# EAGLE schematic Project_schematic (EAGLE 9.6.1)
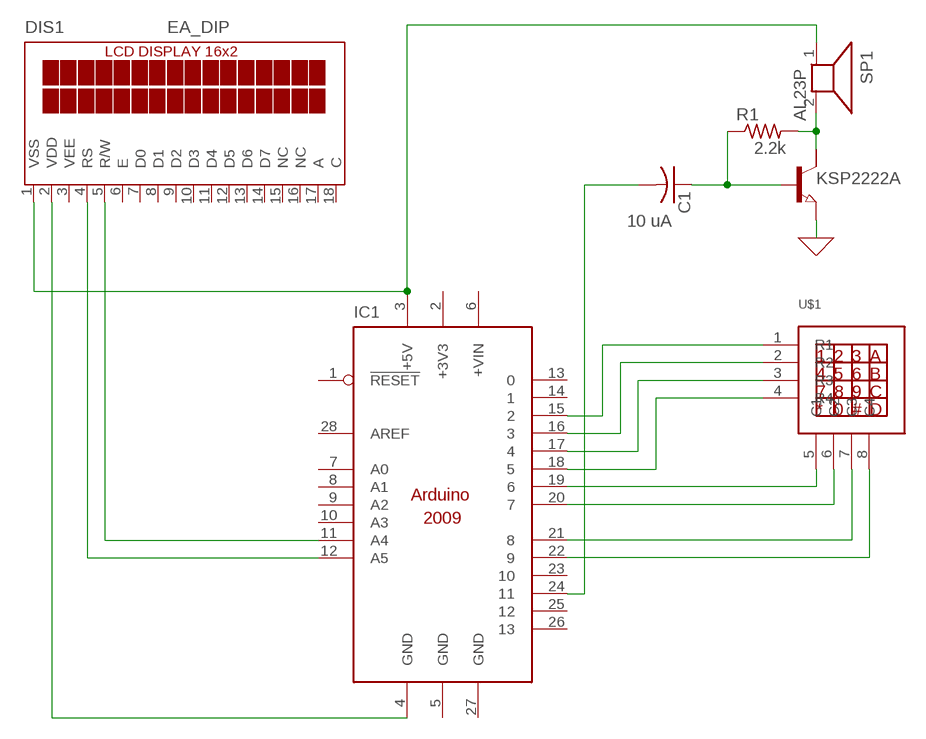
[diagram p0: schematic, sheet 1]

## Parts
C1  10 uA  C-US025-040X050  [C025-040X050]
DIS1  EA_DIP  [EA_DIP]
IC1  ARDUINO2009_10  [ARDUINO2009]
KSP2222A  NPN-TRANSISTIOR-2COLSOT89  [SOT89]
R1  2.2k  R-US_0204/7  [0204/7]
SP1  AL23P  [AL23P]
U$1  KEYPAD4X4  [KEYPAD4X4]

## Nets
N$1: DIS1.1(VSS) IC1.3(+5V) SP1.1
N$2: DIS1.2(VDD) IC1.4(GND)
N$3: DIS1.4(RS) IC1.12(A5)
N$4: DIS1.5(R/W) IC1.11(A4)
N$5: IC1.15 U$1.1(R1)
N$6: IC1.16 U$1.2(R2)
N$7: IC1.17 U$1.3(R3)
N$8: IC1.18 U$1.4(R4)
N$9: IC1.19 U$1.5(C1)
N$10: IC1.20 U$1.6(C2)
N$11: IC1.21 U$1.7(C3)
N$12: IC1.22 U$1.8(C4)
N$13: KSP2222A.2(C) R1.2 SP1.2
N$14: C1.1 KSP2222A.1(B) R1.1
N$15: C1.2 IC1.24
N$16: KSP2222A.3(E) ; supply symbol labelled GND
Unconnected: DIS1.6(E) DIS1.7(D0) DIS1.8(D1) DIS1.9(D2) DIS1.10(D3) DIS1.11(D4) DIS1.12(D5) DIS1.13(D6) DIS1.14(D7) DIS1.15(NC) DIS1.16(NC) DIS1.17(A) DIS1.18(C) IC1.1(!RESET) IC1.6(+VIN) IC1.7(A0) IC1.8(A1) IC1.9(A2) IC1.10(A3) IC1.13 IC1.14 IC1.23 IC1.25 IC1.26 IC1.28(AREF) KSP2222A.2@1(C/)

## Power pins joined to a net without a drawn wire
+3V3: IC1.2(+3V3)
GND: IC1.5(GND) IC1.27(GND)
VEE: DIS1.3(VEE)

## Library data of the parts
C1 = rcl:C-US: CAPACITOR, American symbol; SPICEPREFIX: C
DIS1 = display-lcd:EA_DIP: LCD-MODUL 2x16 - 6,68mm, INKL. KONTROLLER HD44780 Source: Data sheet <http://www.lcd-module.de/pdf/doma/dip162-d.pdf>
IC1 = arduino:ARDUINO2009_1: The Arduino Duemilanove ("2009") is a microcontroller board based on the ATmega168 or ATmega328. - 14 digital input/output pins (of which 6 can be used as PWM outputs) - 6 analog inputs, a 16 MHz crystal oscillator - USB connection - power jack - ISP header - reset button It contains everything needed to support the microcontroller; simply connect it to a computer with a USB cable or power it with a AC-to-DC adapter or battery to get started http://arduino.cc/en/Main/ArduinoBoardDuemilanove
KSP2222A = semicon-smd-ipc:NPN-TRANSISTIOR-2COL: NPN TRANSISTOR 2 colletor pins
R1 = rcl:R-US_: RESISTOR, American symbol; SPICEPREFIX: R
SP1 = buzzer:AL23P: SPEAKER Source: Buerklin; OC_FARNELL: unknown; OC_NEWARK: unknown
U$1 = keypad4x4_ece:KEYPAD4X4